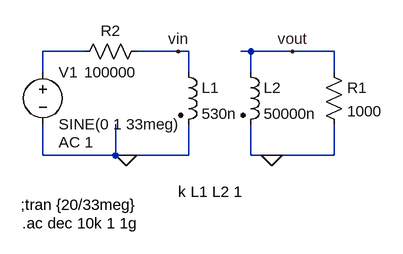
[diagram p0: schematic transformer.asc]
transformer.asc, the LTspice schematic file:
Version 4
SHEET 1 880 680
WIRE -16 80 -80 80
WIRE 128 80 64 80
WIRE 144 80 128 80
WIRE 240 80 224 80
WIRE 304 80 240 80
WIRE 368 80 304 80
WIRE -80 112 -80 80
WIRE 144 112 144 80
WIRE 240 112 240 80
WIRE 368 112 368 80
WIRE -80 240 -80 192
WIRE 32 240 32 192
WIRE 32 240 -80 240
WIRE 48 240 32 240
WIRE 144 240 144 192
WIRE 144 240 48 240
WIRE 240 240 240 192
WIRE 272 240 240 240
WIRE 368 240 368 192
WIRE 368 240 272 240
FLAG 48 240 0
FLAG 272 240 0
FLAG 304 80 vout
FLAG 128 80 vin
SYMBOL ind2 128 96 R0
SYMATTR InstName L1
SYMATTR Value 530n
SYMATTR Type ind
SYMBOL ind2 224 96 R0
SYMATTR InstName L2
SYMATTR Value 50000n
SYMATTR Type ind
SYMBOL res 352 96 R0
SYMATTR InstName R1
SYMATTR Value 1000
SYMBOL voltage -80 96 R0
WINDOW 123 24 124 Left 2
WINDOW 39 0 0 Left 0
SYMATTR InstName V1
SYMATTR Value SINE(0 1 33meg)
SYMATTR Value2 AC 1
SYMBOL res 80 64 R90
WINDOW 0 0 56 VBottom 2
WINDOW 3 32 56 VTop 2
SYMATTR InstName R2
SYMATTR Value 100000
TEXT 128 296 Left 2 !k L1 L2 1
TEXT -114 316 Left 2 !;tran {20/33meg}
TEXT -112 344 Left 2 !.ac dec 10k 1 1g

The netlist it stands for:
* transformer.asc
L1 vin 0 530n
L2 vout 0 50000n
R1 vout 0 1000
V1 N001 0 SINE(0 1 33meg) AC 1
R2 vin N001 100000
k L1 L2 1
;tran {20/33meg}
.ac dec 10k 1 1g
.backanno
.end